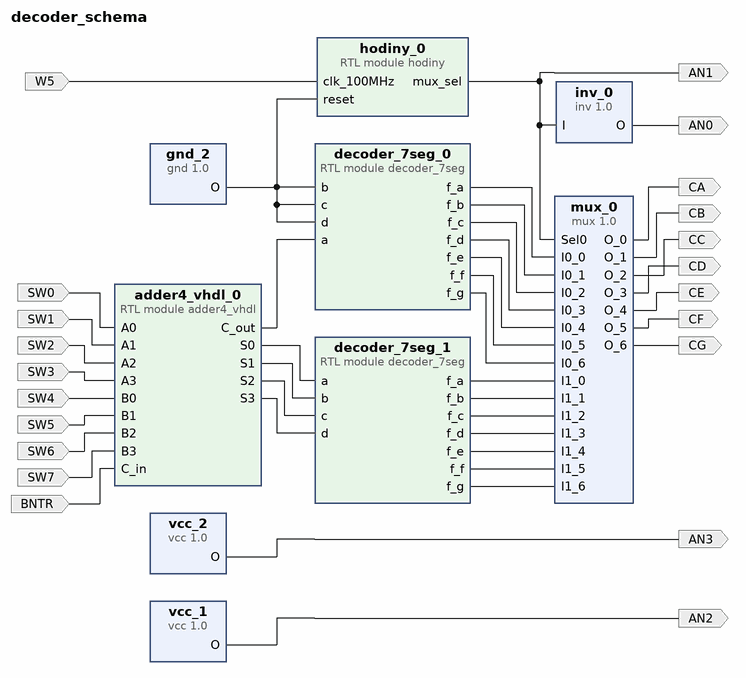
[diagram p0: block diagram of the top level]
# Vivado block design decoder_schema, xc7a35tcpg236-1, Vivado 2018.3
create_bd_design decoder_schema

create_bd_port -dir I SW0
create_bd_port -dir I SW1
create_bd_port -dir I SW2
create_bd_port -dir I SW3
create_bd_port -dir O CA
create_bd_port -dir O CB
create_bd_port -dir O CC
create_bd_port -dir O CD
create_bd_port -dir O CE
create_bd_port -dir O CF
create_bd_port -dir O CG
create_bd_port -dir O AN0
create_bd_port -dir O AN1
create_bd_port -dir O AN3
create_bd_port -dir O AN2
create_bd_port -dir I SW4
create_bd_port -dir I SW5
create_bd_port -dir I SW6
create_bd_port -dir I SW7
create_bd_port -dir I BNTR
create_bd_port -dir I W5

create_bd_cell -type ip -vlnv FIT:user:vcc:1.0 vcc_1
create_bd_cell -type ip -vlnv FIT:user:vcc:1.0 vcc_2
create_bd_cell -type module -reference adder4_vhdl adder4_vhdl_0
create_bd_cell -type module -reference hodiny hodiny_0
create_bd_cell -type ip -vlnv FIT:user:gnd:1.0 gnd_2
create_bd_cell -type ip -vlnv FIT:user:inv:1.0 inv_0
create_bd_cell -type module -reference decoder_7seg decoder_7seg_0
create_bd_cell -type module -reference decoder_7seg decoder_7seg_1
create_bd_cell -type ip -vlnv FIT:user:mux:1.0 mux_0
set_property -dict {CONFIG.WIDTH 7} [get_bd_cells mux_0]

# ---- connections ----

connect_bd_net [get_bd_pins vcc_2/O] [get_bd_ports AN3]
connect_bd_net [get_bd_pins vcc_1/O] [get_bd_ports AN2]
connect_bd_net -net SW0_1 [get_bd_ports SW0] [get_bd_pins adder4_vhdl_0/A0]
connect_bd_net -net SW1_1 [get_bd_ports SW1] [get_bd_pins adder4_vhdl_0/A1]
connect_bd_net -net SW2_1 [get_bd_ports SW2] [get_bd_pins adder4_vhdl_0/A2]
connect_bd_net -net SW3_1 [get_bd_ports SW3] [get_bd_pins adder4_vhdl_0/A3]
connect_bd_net -net SW4_1 [get_bd_ports SW4] [get_bd_pins adder4_vhdl_0/B0]
connect_bd_net -net SW5_1 [get_bd_ports SW5] [get_bd_pins adder4_vhdl_0/B1]
connect_bd_net -net SW6_1 [get_bd_ports SW6] [get_bd_pins adder4_vhdl_0/B2]
connect_bd_net -net SW7_1 [get_bd_ports SW7] [get_bd_pins adder4_vhdl_0/B3]
connect_bd_net [get_bd_ports BNTR] [get_bd_pins adder4_vhdl_0/C_in]
connect_bd_net [get_bd_pins gnd_2/O] \
  [get_bd_pins hodiny_0/reset] [get_bd_pins decoder_7seg_0/b] [get_bd_pins decoder_7seg_0/c] [get_bd_pins decoder_7seg_0/d]
connect_bd_net [get_bd_pins hodiny_0/mux_sel] [get_bd_ports AN1] [get_bd_pins inv_0/I] [get_bd_pins mux_0/Sel0]
connect_bd_net -net clk_100MHz_0_1 [get_bd_ports W5] [get_bd_pins hodiny_0/clk_100MHz]
connect_bd_net [get_bd_pins inv_0/O] [get_bd_ports AN0]
connect_bd_net [get_bd_pins adder4_vhdl_0/S0] [get_bd_pins decoder_7seg_1/a]
connect_bd_net [get_bd_pins adder4_vhdl_0/S1] [get_bd_pins decoder_7seg_1/b]
connect_bd_net [get_bd_pins adder4_vhdl_0/S2] [get_bd_pins decoder_7seg_1/c]
connect_bd_net [get_bd_pins adder4_vhdl_0/S3] [get_bd_pins decoder_7seg_1/d]
connect_bd_net [get_bd_pins adder4_vhdl_0/C_out] [get_bd_pins decoder_7seg_0/a]
connect_bd_net [get_bd_pins mux_0/O_0] [get_bd_ports CA]
connect_bd_net [get_bd_pins mux_0/O_1] [get_bd_ports CB]
connect_bd_net [get_bd_pins mux_0/O_2] [get_bd_ports CC]
connect_bd_net [get_bd_pins mux_0/O_3] [get_bd_ports CD]
connect_bd_net [get_bd_pins mux_0/O_4] [get_bd_ports CE]
connect_bd_net [get_bd_pins mux_0/O_5] [get_bd_ports CF]
connect_bd_net [get_bd_pins mux_0/O_6] [get_bd_ports CG]
connect_bd_net [get_bd_pins decoder_7seg_0/f_a] [get_bd_pins mux_0/I0_0]
connect_bd_net [get_bd_pins decoder_7seg_0/f_b] [get_bd_pins mux_0/I0_1]
connect_bd_net [get_bd_pins decoder_7seg_0/f_c] [get_bd_pins mux_0/I0_2]
connect_bd_net [get_bd_pins decoder_7seg_0/f_d] [get_bd_pins mux_0/I0_3]
connect_bd_net [get_bd_pins decoder_7seg_0/f_e] [get_bd_pins mux_0/I0_4]
connect_bd_net [get_bd_pins decoder_7seg_0/f_f] [get_bd_pins mux_0/I0_5]
connect_bd_net [get_bd_pins decoder_7seg_0/f_g] [get_bd_pins mux_0/I0_6]
connect_bd_net [get_bd_pins decoder_7seg_1/f_a] [get_bd_pins mux_0/I1_0]
connect_bd_net [get_bd_pins decoder_7seg_1/f_b] [get_bd_pins mux_0/I1_1]
connect_bd_net [get_bd_pins decoder_7seg_1/f_c] [get_bd_pins mux_0/I1_2]
connect_bd_net [get_bd_pins decoder_7seg_1/f_d] [get_bd_pins mux_0/I1_3]
connect_bd_net [get_bd_pins decoder_7seg_1/f_e] [get_bd_pins mux_0/I1_4]
connect_bd_net [get_bd_pins decoder_7seg_1/f_f] [get_bd_pins mux_0/I1_5]
connect_bd_net [get_bd_pins decoder_7seg_1/f_g] [get_bd_pins mux_0/I1_6]

validate_bd_design
save_bd_design
